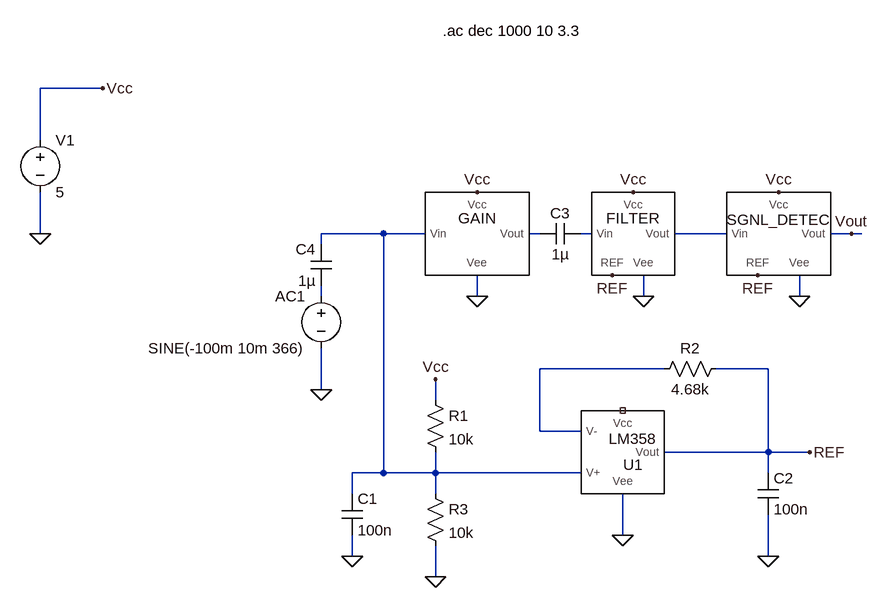
[diagram p0: schematic FULL_MODEL.asc]
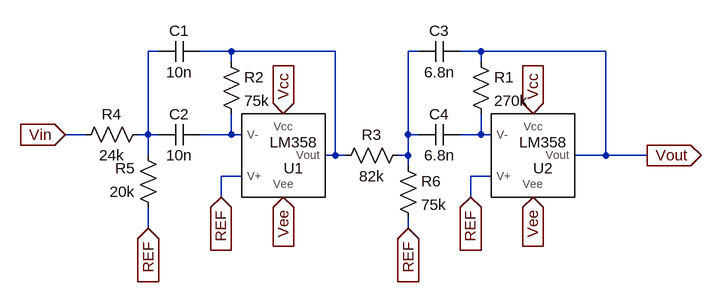
[diagram p1: sub-circuit filter_stage.asc]
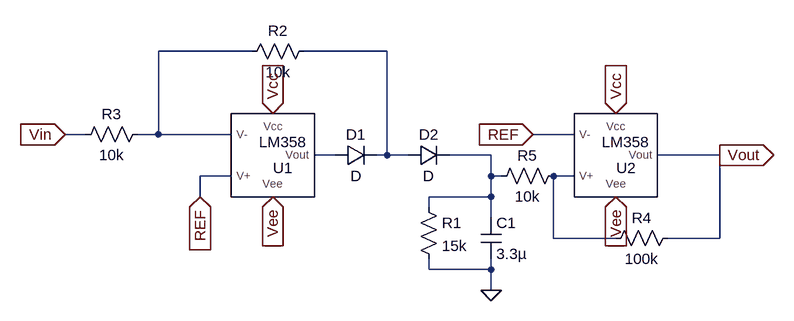
[diagram p2: sub-circuit peak_detection.asc]
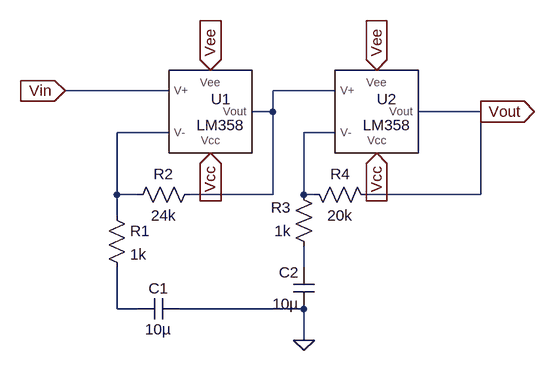
[diagram p3: sub-circuit gain_stage_1.asc]
FULL_MODEL.asc, the LTspice schematic file:
Version 4
SHEET 1 880 792
WIRE -608 -64 -704 -64
WIRE -704 16 -704 -64
WIRE -704 160 -704 96
WIRE -176 160 -272 160
WIRE -112 160 -176 160
WIRE 64 160 48 160
WIRE 144 160 128 160
WIRE 352 160 272 160
WIRE 544 160 512 160
WIRE 560 160 544 160
WIRE -272 176 -272 160
WIRE -272 256 -272 240
WIRE -32 256 -32 224
WIRE 224 256 224 224
WIRE 464 256 464 224
WIRE 256 368 64 368
WIRE 416 368 336 368
WIRE -272 400 -272 336
WIRE -96 416 -96 384
WIRE 64 464 64 368
WIRE 128 464 64 464
WIRE 416 496 416 368
WIRE 416 496 256 496
WIRE 480 496 416 496
WIRE -176 528 -176 160
WIRE -176 528 -224 528
WIRE -96 528 -96 496
WIRE -96 528 -176 528
WIRE 128 528 -96 528
WIRE 416 528 416 496
WIRE -224 560 -224 528
WIRE -96 560 -96 528
WIRE 192 624 192 560
WIRE -224 656 -224 624
WIRE 416 656 416 592
WIRE -96 688 -96 640
FLAG -32 256 0
FLAG 224 256 0
FLAG 464 256 0
FLAG -272 400 0
FLAG 192 624 0
FLAG -704 160 0
FLAG -608 -64 Vcc
FLAG -32 96 Vcc
FLAG 208 96 Vcc
FLAG 432 96 Vcc
FLAG -96 688 0
FLAG 416 656 0
FLAG -224 656 0
FLAG -96 384 Vcc
FLAG 480 496 REF
FLAG 400 224 REF
FLAG 176 224 REF
FLAG 544 160 Vout
SYMBOL filter_stage 208 160 R0
SYMATTR InstName FILTER
SYMBOL peak_detection 432 160 R0
SYMATTR InstName SGNL_DETEC
SYMBOL gain_stage_1 -32 160 R0
SYMATTR InstName GAIN
SYMBOL LM358 208 496 R0
SYMATTR InstName U1
SYMBOL voltage -704 0 R0
WINDOW 123 0 0 Left 0
WINDOW 39 0 0 Left 0
SYMATTR InstName V1
SYMATTR Value 5
SYMBOL voltage -272 240 M0
WINDOW 123 0 0 Left 0
WINDOW 39 0 0 Left 0
SYMATTR InstName AC1
SYMATTR Value SINE(-100m 10m 366)
SYMBOL res 352 352 R90
WINDOW 0 0 56 VBottom 2
WINDOW 3 32 56 VTop 2
SYMATTR InstName R2
SYMATTR Value 4.68k
SYMBOL res -112 400 R0
SYMATTR InstName R1
SYMATTR Value 10k
SYMBOL res -112 544 R0
SYMATTR InstName R3
SYMATTR Value 10k
SYMBOL cap -240 560 R0
SYMATTR InstName C1
SYMATTR Value 100n
SYMBOL cap 400 528 R0
SYMATTR InstName C2
SYMATTR Value 100n
SYMBOL cap 128 144 R90
WINDOW 0 0 32 VBottom 2
WINDOW 3 32 32 VTop 2
SYMATTR InstName C3
SYMATTR Value 1µ
SYMBOL cap -256 240 R180
WINDOW 0 24 56 Left 2
WINDOW 3 24 8 Left 2
SYMATTR InstName C4
SYMATTR Value 1µ
TEXT 128 -152 Right 2 !.ac dec 1000 10 3.3

filter_stage.asc, the sub-circuit schematic file:
Version 4
SHEET 1 880 680
WIRE -16 16 -32 16
WIRE 96 16 48 16
WIRE 256 16 96 16
WIRE 384 16 368 16
WIRE 480 16 448 16
WIRE 672 16 480 16
WIRE 96 32 96 16
WIRE 480 32 480 16
WIRE -128 144 -160 144
WIRE -32 144 -32 16
WIRE -32 144 -48 144
WIRE -16 144 -32 144
WIRE 96 144 96 112
WIRE 96 144 48 144
WIRE 112 144 96 144
WIRE 368 144 368 16
WIRE 384 144 368 144
WIRE 480 144 480 112
WIRE 480 144 448 144
WIRE 496 144 480 144
WIRE -32 176 -32 144
WIRE 256 176 256 16
WIRE 256 176 240 176
WIRE 272 176 256 176
WIRE 368 176 368 144
WIRE 368 176 352 176
WIRE 672 176 672 16
WIRE 672 176 624 176
WIRE 736 176 672 176
WIRE 368 192 368 176
WIRE 112 208 80 208
WIRE 496 208 464 208
WIRE 80 240 80 208
WIRE 464 240 464 208
WIRE -32 288 -32 256
WIRE 368 288 368 272
FLAG -32 288 REF
IOPIN -32 288 In
FLAG -160 144 Vin
IOPIN -160 144 In
FLAG 736 176 Vout
IOPIN 736 176 Out
FLAG 560 112 Vcc
IOPIN 560 112 In
FLAG 176 112 Vcc
IOPIN 176 112 In
FLAG 560 240 Vee
IOPIN 560 240 In
FLAG 80 240 REF
IOPIN 80 240 In
FLAG 368 288 REF
IOPIN 368 288 In
FLAG 464 240 REF
IOPIN 464 240 In
FLAG 176 240 Vee
IOPIN 176 240 In
SYMBOL LM358 192 176 R0
SYMATTR InstName U1
SYMBOL LM358 576 176 R0
SYMATTR InstName U2
SYMBOL cap 48 128 R90
WINDOW 0 0 32 VBottom 2
WINDOW 3 32 32 VTop 2
SYMATTR InstName C2
SYMATTR Value 10n
SYMBOL cap 448 0 R90
WINDOW 0 0 32 VBottom 2
WINDOW 3 32 32 VTop 2
SYMATTR InstName C3
SYMATTR Value 6.8n
SYMBOL cap 448 128 R90
WINDOW 0 0 32 VBottom 2
WINDOW 3 32 32 VTop 2
SYMATTR InstName C4
SYMATTR Value 6.8n
SYMBOL res 464 16 R0
SYMATTR InstName R1
SYMATTR Value 270k
SYMBOL cap -16 0 M90
WINDOW 0 0 32 VBottom 2
WINDOW 3 32 32 VTop 2
SYMATTR InstName C1
SYMATTR Value 10n
SYMBOL res 80 16 R0
SYMATTR InstName R2
SYMATTR Value 75k
SYMBOL res 368 160 R90
WINDOW 0 0 56 VBottom 2
WINDOW 3 32 56 VTop 2
SYMATTR InstName R3
SYMATTR Value 82k
SYMBOL res -32 128 R90
WINDOW 0 0 56 VBottom 2
WINDOW 3 32 56 VTop 2
SYMATTR InstName R4
SYMATTR Value 24k
SYMBOL res -16 272 R180
WINDOW 0 36 76 Left 2
WINDOW 3 36 40 Left 2
SYMATTR InstName R5
SYMATTR Value 20k
SYMBOL res 352 176 R0
SYMATTR InstName R6
SYMATTR Value 75k

peak_detection.asc, the sub-circuit schematic file:
Version 4
SHEET 1 880 680
WIRE 16 16 -128 16
WIRE 224 16 96 16
WIRE -240 144 -272 144
WIRE -128 144 -128 16
WIRE -128 144 -160 144
WIRE -16 144 -128 144
WIRE 512 144 448 144
WIRE 144 176 112 176
WIRE 224 176 224 16
WIRE 224 176 208 176
WIRE 256 176 224 176
WIRE 384 176 320 176
WIRE 736 176 640 176
WIRE -16 208 -64 208
WIRE 384 208 384 176
WIRE 400 208 384 208
WIRE 512 208 480 208
WIRE -64 240 -64 208
WIRE 384 240 384 208
WIRE 384 240 288 240
WIRE 288 256 288 240
WIRE 384 272 384 240
WIRE 480 304 480 208
WIRE 576 304 480 304
WIRE 736 304 736 176
WIRE 736 304 656 304
WIRE 288 352 288 336
WIRE 384 352 384 336
WIRE 384 352 288 352
WIRE 384 384 384 352
FLAG 48 112 Vcc
IOPIN 48 112 In
FLAG 576 112 Vcc
IOPIN 576 112 In
FLAG 576 240 Vee
IOPIN 576 240 In
FLAG 48 240 Vee
IOPIN 48 240 In
FLAG -64 240 REF
IOPIN -64 240 In
FLAG 448 144 REF
IOPIN 448 144 In
FLAG -272 144 Vin
IOPIN -272 144 In
FLAG 384 384 0
FLAG 736 176 Vout
IOPIN 736 176 Out
SYMBOL LM358 64 176 R0
SYMATTR InstName U1
SYMBOL LM358 592 176 R0
SYMATTR InstName U2
SYMBOL diode 144 192 R270
WINDOW 0 32 32 VTop 2
WINDOW 3 0 32 VBottom 2
SYMATTR InstName D1
SYMBOL diode 256 192 R270
WINDOW 0 32 32 VTop 2
WINDOW 3 0 32 VBottom 2
SYMATTR InstName D2
SYMBOL res 272 240 R0
SYMATTR InstName R1
SYMATTR Value 15k
SYMBOL cap 368 272 R0
SYMATTR InstName C1
SYMATTR Value 3.3µ
SYMBOL res 112 0 R90
WINDOW 0 0 56 VBottom 2
WINDOW 3 32 56 VTop 2
SYMATTR InstName R2
SYMATTR Value 10k
SYMBOL res -144 128 R90
WINDOW 0 0 56 VBottom 2
WINDOW 3 32 56 VTop 2
SYMATTR InstName R3
SYMATTR Value 10k
SYMBOL res 672 288 R90
WINDOW 0 0 56 VBottom 2
WINDOW 3 32 56 VTop 2
SYMATTR InstName R4
SYMATTR Value 100k
SYMBOL res 496 192 R90
WINDOW 0 0 56 VBottom 2
WINDOW 3 32 56 VTop 2
SYMATTR InstName R5
SYMATTR Value 10k

gain_stage_1.asc, the sub-circuit schematic file:
Version 4
SHEET 1 880 680
WIRE 64 160 -96 160
WIRE 320 160 224 160
WIRE 224 192 224 160
WIRE 224 192 192 192
WIRE 544 192 448 192
WIRE 64 224 -16 224
WIRE 320 224 272 224
WIRE -16 320 -16 224
WIRE 16 320 -16 320
WIRE 224 320 224 192
WIRE 224 320 96 320
WIRE 272 320 272 224
WIRE 288 320 272 320
WIRE 544 320 544 192
WIRE 544 320 368 320
WIRE -16 352 -16 320
WIRE 272 432 272 400
WIRE -16 496 -16 432
WIRE 16 496 -16 496
WIRE 272 496 80 496
WIRE 272 544 272 496
FLAG 128 256 Vcc
IOPIN 128 256 In
FLAG 128 128 Vee
IOPIN 128 128 In
FLAG 272 544 0
FLAG -96 160 Vin
IOPIN -96 160 In
FLAG 544 192 Vout
IOPIN 544 192 Out
FLAG 384 128 Vee
IOPIN 384 128 In
FLAG 384 256 Vcc
IOPIN 384 256 In
SYMBOL res -32 336 R0
SYMATTR InstName R1
SYMATTR Value 1k
SYMBOL res 112 304 R90
WINDOW 0 0 56 VBottom 2
WINDOW 3 32 56 VTop 2
SYMATTR InstName R2
SYMATTR Value 24k
SYMBOL res 288 416 R180
WINDOW 0 36 76 Left 2
WINDOW 3 36 40 Left 2
SYMATTR InstName R3
SYMATTR Value 1k
SYMBOL res 272 304 M90
WINDOW 0 0 56 VBottom 2
WINDOW 3 32 56 VTop 2
SYMATTR InstName R4
SYMATTR Value 20k
SYMBOL cap 80 480 R90
WINDOW 0 0 32 VBottom 2
WINDOW 3 32 32 VTop 2
SYMATTR InstName C1
SYMATTR Value 10µ
SYMBOL cap 288 496 R180
WINDOW 0 24 56 Left 2
WINDOW 3 24 8 Left 2
SYMATTR InstName C2
SYMATTR Value 10µ
SYMBOL LM358 144 192 M180
SYMATTR InstName U1
SYMBOL LM358 400 192 M180
SYMATTR InstName U2

The netlist it stands for:
* FULL_MODEL.asc
XFILTER REF Vcc 0 N003 N004 filter_stage
XSGNL_DETEC Vcc 0 N004 Vout REF peak_detection
XGAIN Vcc 0 N001 N002 gain_stage_1
XU1 N006 N001 REF NC_01 0 LM358  ; pins V- V+ Vout Vcc Vee
V1 Vcc 0 5
V§AC1 N005 0 SINE(-100m 10m 366)
R2 REF N006 4.68k
R1 Vcc N001 10k
R3 N001 0 10k
C1 N001 0 100n
C2 REF 0 100n
C3 N003 N002 1µ
C4 N005 N001 1µ

* block symbol definitions
.subckt filter_stage REF Vcc Vee Vin Vout
XU1 N004 REF N002 Vcc Vee LM358  ; pins V- V+ Vout Vcc Vee
XU2 N005 REF Vout Vcc Vee LM358  ; pins V- V+ Vout Vcc Vee
C2 N004 N001 10n
C3 Vout N003 6.8n
C4 N005 N003 6.8n
R1 Vout N005 270k
C1 N001 N002 10n
R2 N002 N004 75k
R3 N003 N002 82k
R4 N001 Vin 24k
R5 REF N001 20k
R6 N003 REF 75k
.ends filter_stage

.subckt peak_detection Vcc Vee Vin Vout REF
XU1 N001 REF N003 Vcc Vee LM358  ; pins V- V+ Vout Vcc Vee
XU2 REF N005 Vout Vcc Vee LM358  ; pins V- V+ Vout Vcc Vee
D1 N003 N002 D
D2 N002 N004 D
R1 N004 0 15k
C1 N004 0 3.3µ
R2 N002 N001 10k
R3 N001 Vin 10k
R4 Vout N005 100k
R5 N005 N004 10k
.ends peak_detection

.subckt gain_stage_1 Vcc Vee Vin Vout
R1 N002 N005 1k
R2 N001 N002 24k
R3 N004 N003 1k
R4 N003 Vout 20k
C1 0 N005 10µ
C2 0 N004 10µ
XU1 N002 Vin N001 Vcc Vee LM358  ; pins V- V+ Vout Vcc Vee
XU2 N003 N001 Vout Vcc Vee LM358  ; pins V- V+ Vout Vcc Vee
.ends gain_stage_1

.model D D
.lib standard.dio
.ac dec 1000 10 3.3
.lib C:\Users\leoar\Documents\EE2\Project\Radar\SPICEMODELS\en.lm358\lm358.txt
.backanno
.end